# Altium schematic sheet 1.1.7_Interface_board_GNSS.SchDoc
size A4; DocumentNumber: 9; SheetNumber: 9; SheetTotal: 14
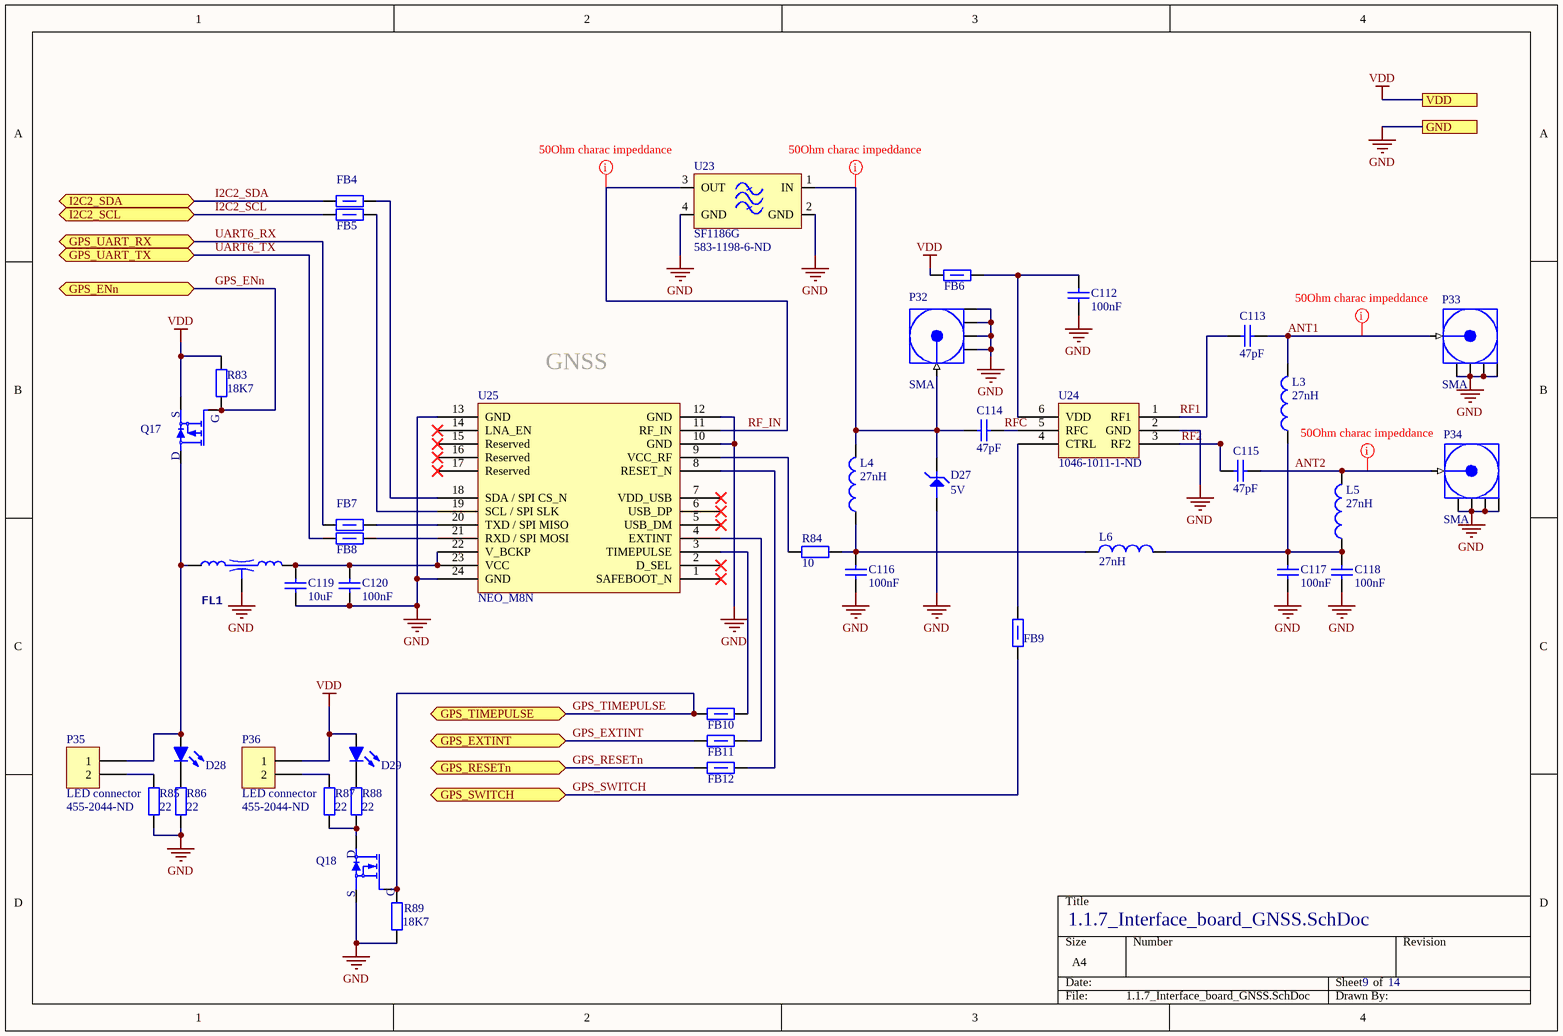
[diagram p0: 1.1.7_Interface_board_GNSS.SchDoc]

## Parts
C112  100nF  [CAP0603R]
C113  47pF  [0402]
C114  47pF  [0402]
C115  47pF  [0402]
C116  100nF  [CAP0603R]
C117  100nF  [CAP0603R]
C118  100nF  [CAP0603R]
C119  10uF  [CAP0805W]
C120  100nF  [CAP0603R]
D27  5V  [SOD-923]
D28  LED  [WL-SMCW]  (value not drawn)
D29  LED  [WL-SMCW]  (value not drawn)
FB4  81-BLM18KG601SZ1D  [0603]  (value not drawn)
FB5  81-BLM18KG601SZ1D  [0603]  (value not drawn)
FB6  81-BLM18KG601SZ1D  [0603]  (value not drawn)
FB7  81-BLM18KG601SZ1D  [0603]  (value not drawn)
FB8  81-BLM18KG601SZ1D  [0603]  (value not drawn)
FB9  81-BLM18KG601SZ1D  [0603]  (value not drawn)
FB10  81-BLM18KG601SZ1D  [0603]  (value not drawn)
FB11  81-BLM18KG601SZ1D  [0603]  (value not drawn)
FB12  81-BLM18KG601SZ1D  [0603]  (value not drawn)
FL1  NFE31P Series (1206 Size)   Chip EMIFILr LC Combined Type  [LCL_NFE31P]  (value not drawn)
L3  27nH  [0402]
L4  27nH  [0402]
L5  27nH  [0402]
L6  27nH  [0402]
P32  SMA  [SMA_TH_VERTICAL_LONG]
P33  SMA  [SMA_TH_VERTICAL_LONG]
P34  SMA  [SMA_TH_VERTICAL_LONG]
P35  LED connector  Supplier Part Number 1: 455-2044-ND  [CON_JST_XA_ S02B-XASS-1]
P36  LED connector  Supplier Part Number 1: 455-2044-ND  [CON_JST_XA_ S02B-XASS-1]
Q17  MOSFET_P  [SOT23]  (value not drawn)
Q18  MOSFET_N  [SOT-323-3]  (value not drawn)
R83  18K7  [0603]
R84  10  [0603]
R85  22  [0603]
R86  22  [0603]
R87  22  [0603]
R88  22  [0603]
R89  18K7  [0603]
U23  SF1186G  Supplier Part Number 1: 583-1198-6-ND  [SMD_2.5X2MM_4P]
U24  Supplier Part Number 1: 1046-1011-1-ND  [SC-70]  (hidden comment: PE4259)
U25  Supplier Part Number 1: NEO_M8N  [NEO-8]  (hidden comment: NEO_M8)

## Ports
GND, GPS_ENn (bidir), GPS_EXTINT (bidir), GPS_RESETn (bidir), GPS_SWITCH (bidir), GPS_TIMEPULSE (bidir), GPS_UART_RX (bidir), GPS_UART_TX (bidir), I2C2_SCL (bidir), I2C2_SDA (bidir), VDD

## Nets
GND: C112.1 C116.1 C117.1 C118.1 C119.1 C120.1 D27.2 FL1.2 P32.2 P32.3 P32.4 P32.5 P33.2 P33.3 P33.4 P33.5 P34.2 P34.3 P34.4 P34.5 Q18.2(S) R85.1 R86.1 R89.2 U23.2(GND) U23.4(GND) U24.2(GND) U25.10(GND) U25.12(GND) U25.13(GND) U25.24(GND) ; port GND
VDD: D29.A FB6.2 P36.1 Q17.2(S) R83.2 ; port VDD
ANT1: C113.1 L3.2 P33.1
ANT2: C115.1 L5.2 P34.1
GPS_ENn: Q17.1(G) R83.1 ; port GPS_ENn
GPS_EXTINT: FB11.2 ; port GPS_EXTINT
GPS_RESETn: FB12.2 ; port GPS_RESETn
GPS_SWITCH: FB9.1 ; port GPS_SWITCH
GPS_TIMEPULSE: FB10.2 Q18.1(G) R89.1 ; port GPS_TIMEPULSE
I2C2_SCL: FB5.1 ; port I2C2_SCL
I2C2_SDA: FB4.1 ; port I2C2_SDA
RF1: C113.2 U24.1(RF1)
RF2: C115.2 U24.3(RF2)
RF_IN: U23.3(OUT) U25.11(RF_IN)
RFC: C114.1 U24.5(RFC)
UART6_RX: FB7.1 ; port GPS_UART_RX
UART6_TX: FB8.1 ; port GPS_UART_TX
NetC112_2: C112.2 FB6.1 U24.6(VDD)
NetC114_2: C114.2 D27.1 L4.2 P32.1 U23.1(IN)
NetC116_2: C116.2 L4.1 L6.1 R84.2
NetC117_2: C117.2 C118.2 L3.1 L5.1 L6.2
NetC119_2: C119.2 C120.2 FL1.3 U25.22(V_BCKP) U25.23(VCC)
NetD28_A: D28.A FL1.1 P35.1 Q17.3(D)
NetD28_C: D28.C R86.2
NetD29_C: D29.C R88.2
NetFB4_2: FB4.2 U25.18(SDA_/_SPI_CS_N)
NetFB5_2: FB5.2 U25.19(SCL_/_SPI_SLK)
NetFB7_2: FB7.2 U25.20(TXD_/_SPI_MISO)
NetFB8_2: FB8.2 U25.21(RXD_/_SPI_MOSI)
NetFB9_2: FB9.2 U24.4(CTRL)
NetFB10_1: FB10.1 U25.3(TIMEPULSE)
NetFB11_1: FB11.1 U25.4(EXTINT)
NetFB12_1: FB12.1 U25.8(RESET_N)
NetP35_2: P35.2 R85.2
NetP36_2: P36.2 R87.2
NetQ18_3: Q18.3(D) R87.1 R88.1
NetR84_1: R84.1 U25.9(VCC_RF)

Not connected (* = marked no-connect by the designer): U25 1(SAFEBOOT_N)* 2(D_SEL)* 5(USB_DM)* 6(USB_DP)* 7(VDD_USB)* 14(LNA_EN)* 15(Reserved)* 16(Reserved)* 17(Reserved)*

## Layout directives
rule Undefined: ANT1, ANT2, NetC114_2, RF_IN

## Notes on the sheet
- (near U25) GNSS

## Library data of the parts
C112 C116-C118 C120 = C_100nF: Capacitor; Supplier 1: Mouser; Supplier Part Number 1: 81-GCG188R91H104KA1D
C113-C115 = C_47pF_50V_0402: Capacitor; Supplier 1: Mouser; Supplier Part Number 1: 810-CGA2B2C0G1H470J
C119 = C_10uF_16v: Capacitor; Supplier 1: Mouser; Supplier Part Number 1: 81-GRT21BC81C106ME1L
D27 = ESD9L5.0ST5G: Diodes TVS - Parasurtenseurs ESD; Supplier 1: Mouser; Supplier Part Number 1: 863-ESD9L5.0ST5G
D28 D29 = LED_SMD_GREEN_0603: Standard LEDs - SMD WL-SMCW Waterclr 0603 Green; Supplier 1: Mouser; Supplier Part Number 1: 710-150060GS75000
FB4-FB12 = Ferrite_bead: Supplier 1: Mouser; Supplier Part Number 1: 81-BLM18KG601SZ1D
FL1 = NFE31P: Supplier 1: Mouser; Supplier Part Number 1: 81-NFE31PT222Z1E9L
L3-L6 = L_27nH_0402: Inductor; Supplier 1: Mouser; Supplier Part Number 1: 81-LQG15HS27NJ02D
P32-P34 = COAX_SMA_PCB: Connecteurs coaxiaux SMA STRAIGHT JACK PCB MOUNT BULKHEAD; Supplier 1: Mouser; Supplier Part Number 1: 523-132291
P35 P36 = Header 2p JST XA 3A right angle: Supplier 1: Digi-Key
Q17 = MOSFET_P_ 20V_1.5A: MOSFET 40V P-channel Trench MOSFET SOT-23-3; Supplier 1: Mouser; Supplier Part Number 1: 771-PMV250EPEAR
Q18 = MOSFET_N_ 20V_1.4A: MOSFET N-Ch 20V 1.4A SOT-323-3; Supplier 1: Mouser; Supplier Part Number 1: 726-SP000917562
R83 R89 = R_0603_01W_18K7: 0.1W 18K7; Supplier 1: Mouser; Supplier Part Number 1: 667-ERJ-3EKF1872V
R84 = R_0603_025W_10Ohm: 0.25W 10Ohm; Supplier 1: Mouser; Supplier Part Number 1: 667-ERJ-PA3J100V
R85-R88 = R_0603_025W_22Ohm: 0.25W 22Ohm; LatestRevisionDate: 17-Jul-2002; LatestRevisionNote: Re-released for DXP Platform.; PackageReference: AXIAL-0.4; PackageDescription: Axial Device, Thru-Hole; 2 Leads; 0.4 in Pin Spacing; Supplier 1: Mouser; Supplier Part Number 1: 667-ERJ-PA3J220V
U23 = SF1186G: SAW GPS Filter; Supplier 1: Digi-Key
U24 = PE4259: RF SWITCH; Supplier 1: Digi-Key
U25 = uBlox_Neo M8: GNSS; Supplier 1: uBlox